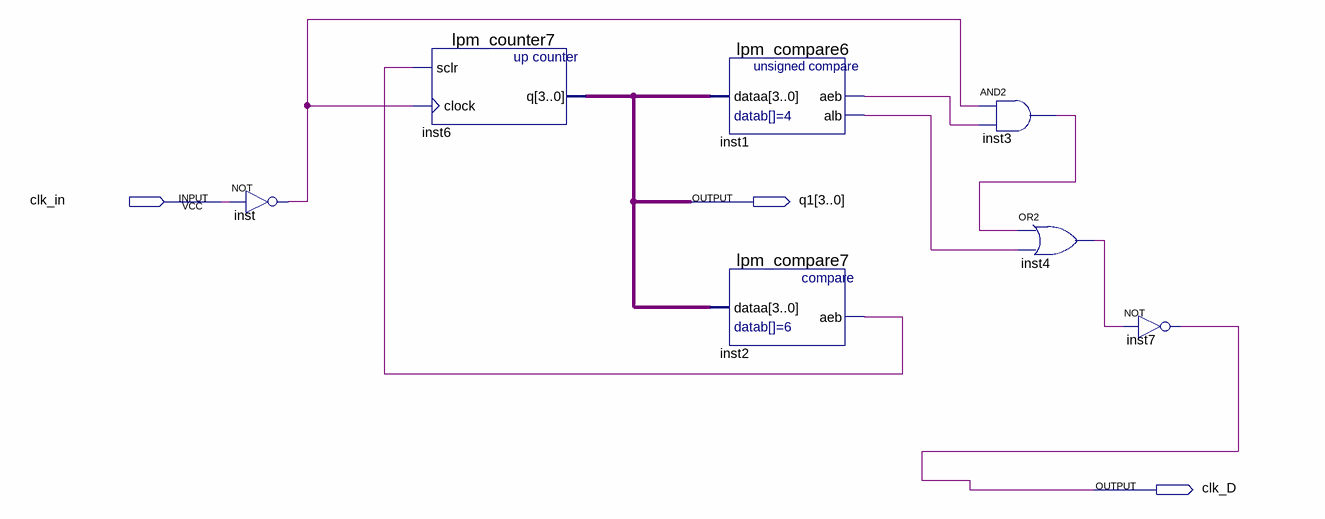
[diagram p0: schematic sheet]
// Quartus schematic Block2_0.bdf as structural Verilog: 7 symbols, 3 pins
module Block2_0 (
  input  clk_in,
  output [3:0] q1,
  output clk_D
);

  wire inst1_aeb, inst1_alb, inst2_aeb, inst3_out, inst4_out, inst_out;

  not inst (inst_out, clk_in);
  lpm_counter7 inst6 (.sclr(inst2_aeb), .clock(inst_out), .q(q1));
  lpm_compare6 inst1 (.dataa(q1), .aeb(inst1_aeb), .alb(inst1_alb));
  lpm_compare7 inst2 (.dataa(q1), .aeb(inst2_aeb));
  and inst3 (inst3_out, inst_out, inst1_aeb);
  or inst4 (inst4_out, inst3_out, inst1_alb);
  not inst7 (clk_D, inst4_out);
endmodule
